# EAGLE design TQFP44 (EAGLE 7.1.0)
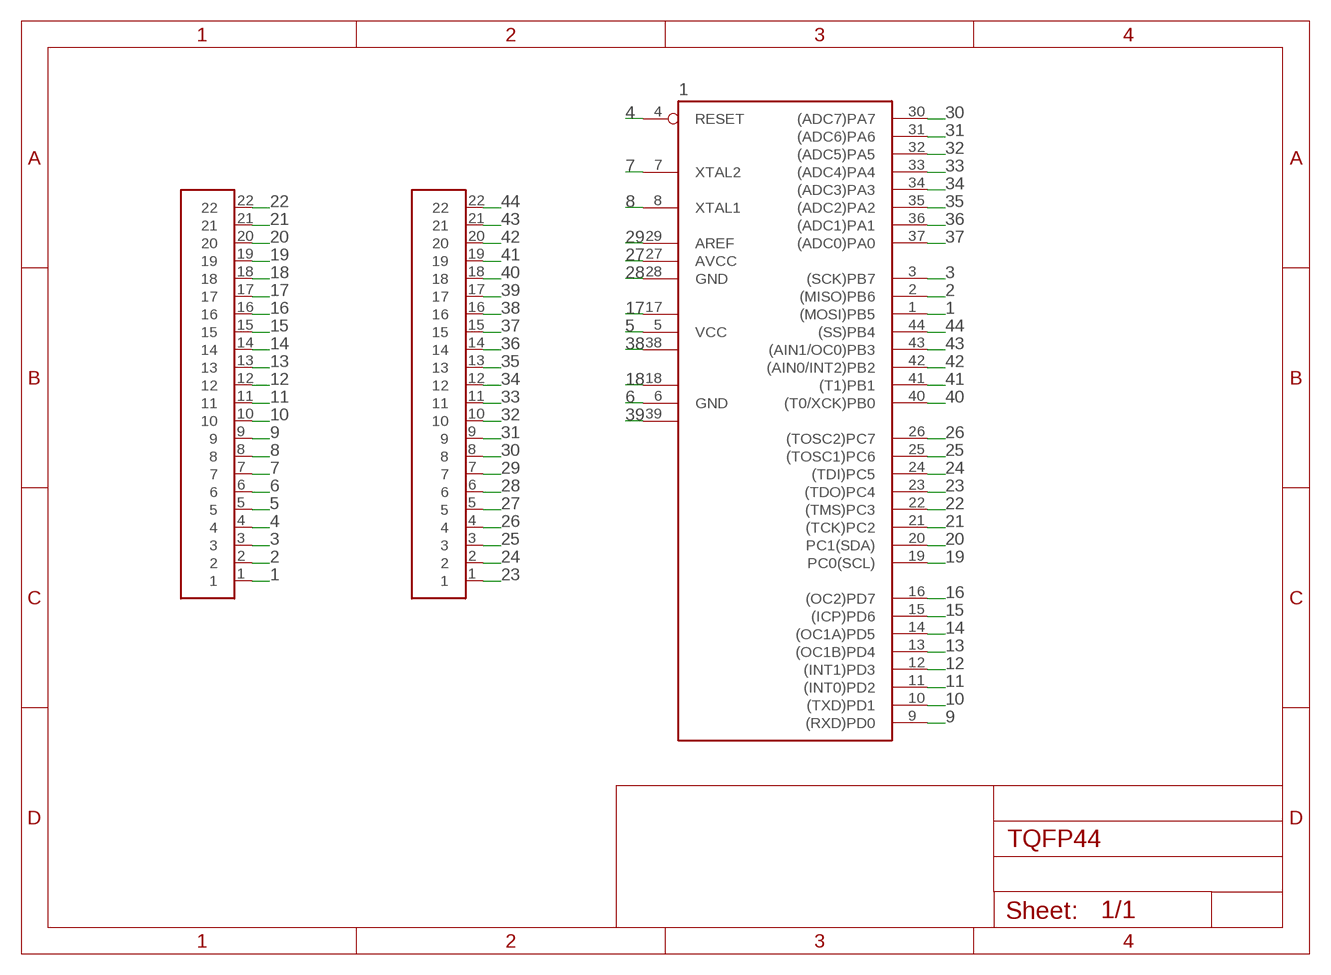
[diagram p0: schematic, sheet 1]

## Parts
1  MEGA32-A  [TQFP44]
2  1X22THM  [1X22]
U$3  1X22THM  [1X22]

## Nets
1: 1.1((MOSI)PB5) 2.1
2: 1.2((MISO)PB6) 2.2
3: 1.3((SCK)PB7) 2.3
4: 1.4(RESET) 2.4
5: 1.5(VCC) 2.5
6: 1.6(GND) 2.6
7: 1.7(XTAL2) 2.7
8: 1.8(XTAL1) 2.8
9: 1.9((RXD)PD0) 2.9
10: 1.10((TXD)PD1) 2.10
11: 1.11((INT0)PD2) 2.11
12: 1.12((INT1)PD3) 2.12
13: 1.13((OC1B)PD4) 2.13
14: 1.14((OC1A)PD5) 2.14
15: 1.15((ICP)PD6) 2.15
16: 1.16((OC2)PD7) 2.16
17: 1.17(VCC1) 2.17
18: 1.18(GND1) 2.18
19: 1.19(PC0(SCL)) 2.19
20: 1.20(PC1(SDA)) 2.20
21: 1.21((TCK)PC2) 2.21
22: 1.22((TMS)PC3) 2.22
23: 1.23((TDO)PC4) U$3.1
24: 1.24((TDI)PC5) U$3.2
25: 1.25((TOSC1)PC6) U$3.3
26: 1.26((TOSC2)PC7) U$3.4
27: 1.27(AVCC) U$3.5
28: 1.28(GND) U$3.6
29: 1.29(AREF) U$3.7
30: 1.30((ADC7)PA7) U$3.8
31: 1.31((ADC6)PA6) U$3.9
32: 1.32((ADC5)PA5) U$3.10
33: 1.33((ADC4)PA4) U$3.11
34: 1.34((ADC3)PA3) U$3.12
35: 1.35((ADC2)PA2) U$3.13
36: 1.36((ADC1)PA1) U$3.14
37: 1.37((ADC0)PA0) U$3.15
38: 1.38(VCC2) U$3.16
39: 1.39(GND2) U$3.17
40: 1.40((T0/XCK)PB0) U$3.18
41: 1.41((T1)PB1) U$3.19
42: 1.42((AIN0/INT2)PB2) U$3.20
43: 1.43((AIN1/OC0)PB3) U$3.21
44: 1.44((SS)PB4) U$3.22

## Library data of the parts
1 = atmel:MEGA32: MICROCONTROLLER 32 Kbytes FLASH 2 Kbytes SRAM 1 Kbytes EEPROM USART 8-channel 10 bit ADC Source: www.atmel.com .. doc2503.pdf; MPN: ATMEGA32-16AU; OC_FARNELL: 9171274; OC_NEWARK: 69K6677
2 U$3 = adafruit:1X22

## Board
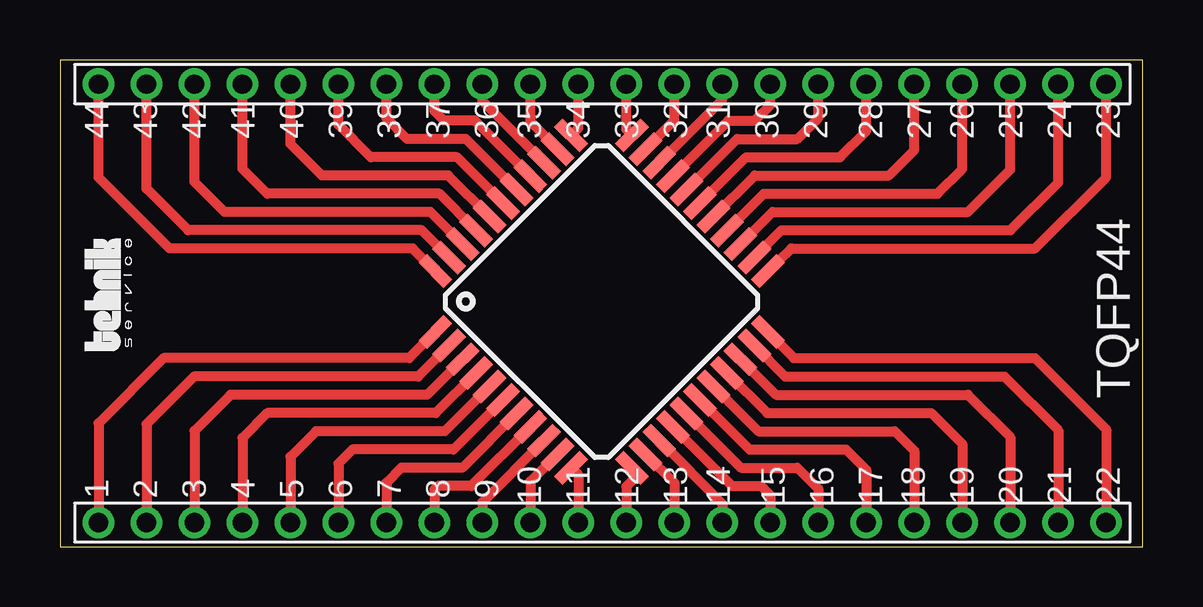
[diagram p1: board, top side]

Size 45.14 x 20.31 mm. Coordinates in mm from the lower left corner, seen from the top.
Outline: 0,0 45.14,0 45.14,20.31 0,20.31 0,0
Copper layers (1*16): Top 0.035mm / dielectric 1.5mm / Bottom 0.035mm
Design rules "default": minimum track width 10mil, minimum drill 24mil, track to track 8mil, track to pad 8mil, pad to pad 8mil, via to via 8mil, smd to smd 8mil, copper to edge 40mil, drill to drill 8mil, minimum pad ring 10mil, minimum via ring 8mil, stop-mask expansion 4mil, vias tented up to drill 0mil, thermal gap 10mil

### Footprints (pad centres in the part's own frame; a part is rotated, then mirrored left to right if it is on the bottom)
TQFP44 = smd 1.5 x 0.5: 1 -5.8,4; 2 -5.8,3.2; 3 -5.8,2.4; 4 -5.8,1.6; 5 -5.8,0.8; 6 -5.8,0; 7 -5.8,-0.8; 8 -5.8,-1.6; 9 -5.8,-2.4; 10 -5.8,-3.2; 11 -5.8,-4; 23 5.8,-4; 24 5.8,-3.2; 25 5.8,-2.4; 26 5.8,-1.6; 27 5.8,-0.8; 28 5.8,0; 29 5.8,0.8; 30 5.8,1.6; 31 5.8,2.4; 32 5.8,3.2; 33 5.8,4 | smd 0.5 x 1.5: 12 -4,-5.8; 13 -3.2,-5.8; 14 -2.4,-5.8; 15 -1.6,-5.8; 16 -0.8,-5.8; 17 0,-5.8; 18 0.8,-5.8; 19 1.6,-5.8; 20 2.4,-5.8; 21 3.2,-5.8; 22 4,-5.8; 34 4,5.8; 35 3.2,5.8; 36 2.4,5.8; 37 1.6,5.8; 38 0.8,5.8; 39 0,5.8; 40 -0.8,5.8; 41 -1.6,5.8; 42 -2.4,5.8; 43 -3.2,5.8; 44 -4,5.8
1X22 = drill 0.8: 1 -21,0; 2 -19,0; 3 -17,0; 4 -15,0; 5 -13,0; 6 -11,0; 7 -9,0; 8 -7,0; 9 -5,0; 10 -3,0; 11 -1,0; 12 1,0; 13 3,0; 14 5,0; 15 7,0; 16 9,0; 17 11,0; 18 13,0; 19 15,0; 20 17,0; 21 19,0; 22 21,0

### Placement (x,y rotation side)
1  22.58,10.23 45 top
2  22.61,1.02 0 top
U$1  [LOGOT]  3.05,8.13 90 top
U$3  22.61,19.3 180 top

### Tracks (layer width: path | path; a pad name or v marks a point on that pad's centre or on a via)
1
  Top 0.406: 1.1 14.56,7.87 4.32,7.87 1.61,5.16 2.1
2
  Top 0.406: 1.2 14.93,7.11 5.59,7.11 3.61,5.13 2.2
3
  Top 0.406: 1.3 15.3,6.35 7.11,6.35 5.61,4.84 2.3
4
  Top 0.406: 1.4 15.67,5.59 8.64,5.59 7.61,4.56 2.4
5
  Top 0.406: 1.5 16.04,4.83 10.67,4.83 9.61,3.76 2.5
6
  Top 0.406: 1.6 16.4,4.06 12.19,4.06 11.61,3.48 2.6
7
  Top 0.406: 1.7 16.77,3.3 14.22,3.3 13.61,2.68 2.7
8
  Top 0.406: 1.8 17.14,2.54 15.75,2.54 15.61,2.4 2.8
9
  Top 0.406: 1.9 17.61,1.87 2.9
10
  Top 0.406: 1.10 19.61,2.74 2.10
11
  Top 0.406: 1.11 21.61,3 2.11
12
  Top 0.406: 1.12 23.88,3.28 23.88,2.79 23.61,2.52 2.12
13
  Top 0.406: 1.13 25.61,2.68 2.13
14
  Top 0.406: 1.14 27.61,1.81 2.14
15
  Top 0.406: 1.15 28.01,2.54 29.21,2.54 29.61,2.14 2.15
16
  Top 0.406: 1.16 28.38,3.3 30.73,3.3 31.61,2.43 2.16
17
  Top 0.406: 1.17 28.75,4.06 32.77,4.06 33.61,3.22 2.17
18
  Top 0.406: 1.18 29.11,4.83 34.8,4.83 35.61,4.02 2.18
19
  Top 0.406: 1.19 29.48,5.59 36.32,5.59 37.61,4.3 2.19
20
  Top 0.406: 1.20 29.85,6.35 37.85,6.35 39.61,4.59 2.20
21
  Top 0.406: 1.21 30.22,7.11 39.37,7.11 41.61,4.88 2.21
22
  Top 0.406: 1.22 30.59,7.87 40.64,7.87 43.61,4.91 2.22
23
  Top 0.406: 1.23 29.94,11.94 29.97,11.94 30.48,12.45 40.64,12.45 43.61,15.41 U$3.1
24
  Top 0.406: 1.24 30.07,13.21 39.62,13.21 41.61,15.19 U$3.2
25
  Top 0.406: 1.25 29.7,13.97 37.85,13.97 39.61,15.73 U$3.3
26
  Top 0.406: 1.26 29.34,14.73 36.58,14.73 37.61,15.76 U$3.4
27
  Top 0.406: 1.27 28.97,15.49 34.54,15.49 35.61,16.56 U$3.5
28
  Top 0.406: 1.28 28.6,16.26 32.51,16.26 33.61,17.35 U$3.6
29
  Top 0.406: 1.29 28.23,17.02 30.73,17.02 31.61,17.89 U$3.7
30
  Top 0.406: 1.30 27.86,17.78 28.96,17.78 29.61,18.43 U$3.8
31
  Top 0.406: 1.31 27.61,18.66 U$3.9
32
  Top 0.406: 1.32 25.61,17.79 U$3.10
33
  Top 0.406: 1.33 23.61,17.41 U$3.11
34
  Top 0.406: 1.34 21.61,17.47 U$3.12
35
  Top 0.406: 1.35 19.61,17.73 U$3.13
36
  Top 0.406: 1.36 17.61,18.6 U$3.14
37
  Top 0.406: 1.37 17.29,17.78 16,17.78 15.61,18.18 U$3.15
38
  Top 0.406: 1.38 16.92,17.02 14.48,17.02 13.61,17.89 U$3.16
39
  Top 0.406: 1.39 16.55,16.26 12.95,16.26 11.61,17.6 U$3.17
40
  Top 0.406: 1.40 16.18,15.49 10.92,15.49 9.61,16.81 U$3.18
41
  Top 0.406: 1.41 15.81,14.73 8.64,14.73 7.61,15.76 U$3.19
42
  Top 0.406: 1.42 15.45,13.97 6.86,13.97 5.61,15.22 U$3.20
43
  Top 0.406: 1.43 15.08,13.21 5.33,13.21 3.61,14.94 U$3.21
44
  Top 0.406: 1.44 14.71,12.45 4.57,12.45 1.61,15.41 U$3.22

### Text on the board
tNames: 44 | 43 | 42 | 41 | 40 | 39 | 38 | 37 | 36 | 35 | 34 | 33 | 32 | 31 | 30 | 29 | 28 | 27 | 26 | 25 | 24 | 23 | TQFP44 | 1 | 2 | 3 | 4 | 5 | 6 | 7 | 8 | 9 | 10 | 11 | 12 | 13 | 14 | 15 | 16 | 17 | 18 | 19 | 20 | 21 | 22